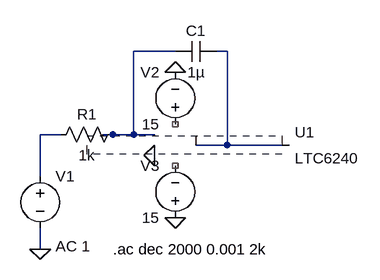
[diagram p0: schematic Active low pass filter.asc]
Active low pass filter.asc, the LTspice schematic file:
Version 4
SHEET 1 880 680
WIRE 96 0 32 0
WIRE 176 0 160 0
WIRE -80 128 -112 128
WIRE 0 128 -16 128
WIRE 32 128 32 0
WIRE 32 128 0 128
WIRE 64 128 32 128
WIRE 176 144 176 0
WIRE 176 144 128 144
WIRE 272 144 176 144
WIRE -112 192 -112 128
WIRE -112 304 -112 272
FLAG 96 256 0
FLAG 64 160 0
FLAG -112 304 0
FLAG 96 32 0
SYMBOL OpAmps\\LTC6240 96 144 R0
SYMATTR InstName U1
SYMBOL res 16 112 R90
WINDOW 0 0 56 VBottom 2
WINDOW 3 32 56 VTop 2
SYMATTR InstName R1
SYMATTR Value 1k
SYMBOL voltage -112 176 R0
WINDOW 123 24 124 Left 2
WINDOW 39 0 0 Left 0
SYMATTR InstName V1
SYMATTR Value ""
SYMATTR Value2 AC 1
SYMBOL cap 160 -16 R90
WINDOW 0 0 32 VBottom 2
WINDOW 3 32 32 VTop 2
SYMATTR InstName C1
SYMATTR Value 1µ
SYMBOL voltage 96 128 R180
WINDOW 0 24 96 Left 2
WINDOW 3 24 16 Left 2
WINDOW 123 0 0 Left 0
WINDOW 39 0 0 Left 0
SYMATTR InstName V2
SYMATTR Value 15
SYMBOL voltage 96 272 R180
WINDOW 0 24 96 Left 2
WINDOW 3 24 16 Left 2
WINDOW 123 0 0 Left 0
WINDOW 39 0 0 Left 0
SYMATTR InstName V3
SYMATTR Value 15
TEXT 0 304 Left 2 !.ac dec 2000 0.001 2k

The netlist it stands for:
* Active low pass filter.asc
* U1: LTC6240 (symbol OpAmps\LTC6240 not available, pin order unknown); nets seen at it: 0, N001, N002
R1 N001 N003 1k
V1 N003 0 AC 1
C1 N002 N001 1µ
V2 NC_01 0 15
V3 0 NC_02 15
.ac dec 2000 0.001 2k
.backanno
.end